# EAGLE schematic Shutdown Circuit (EAGLE 9.6.2)
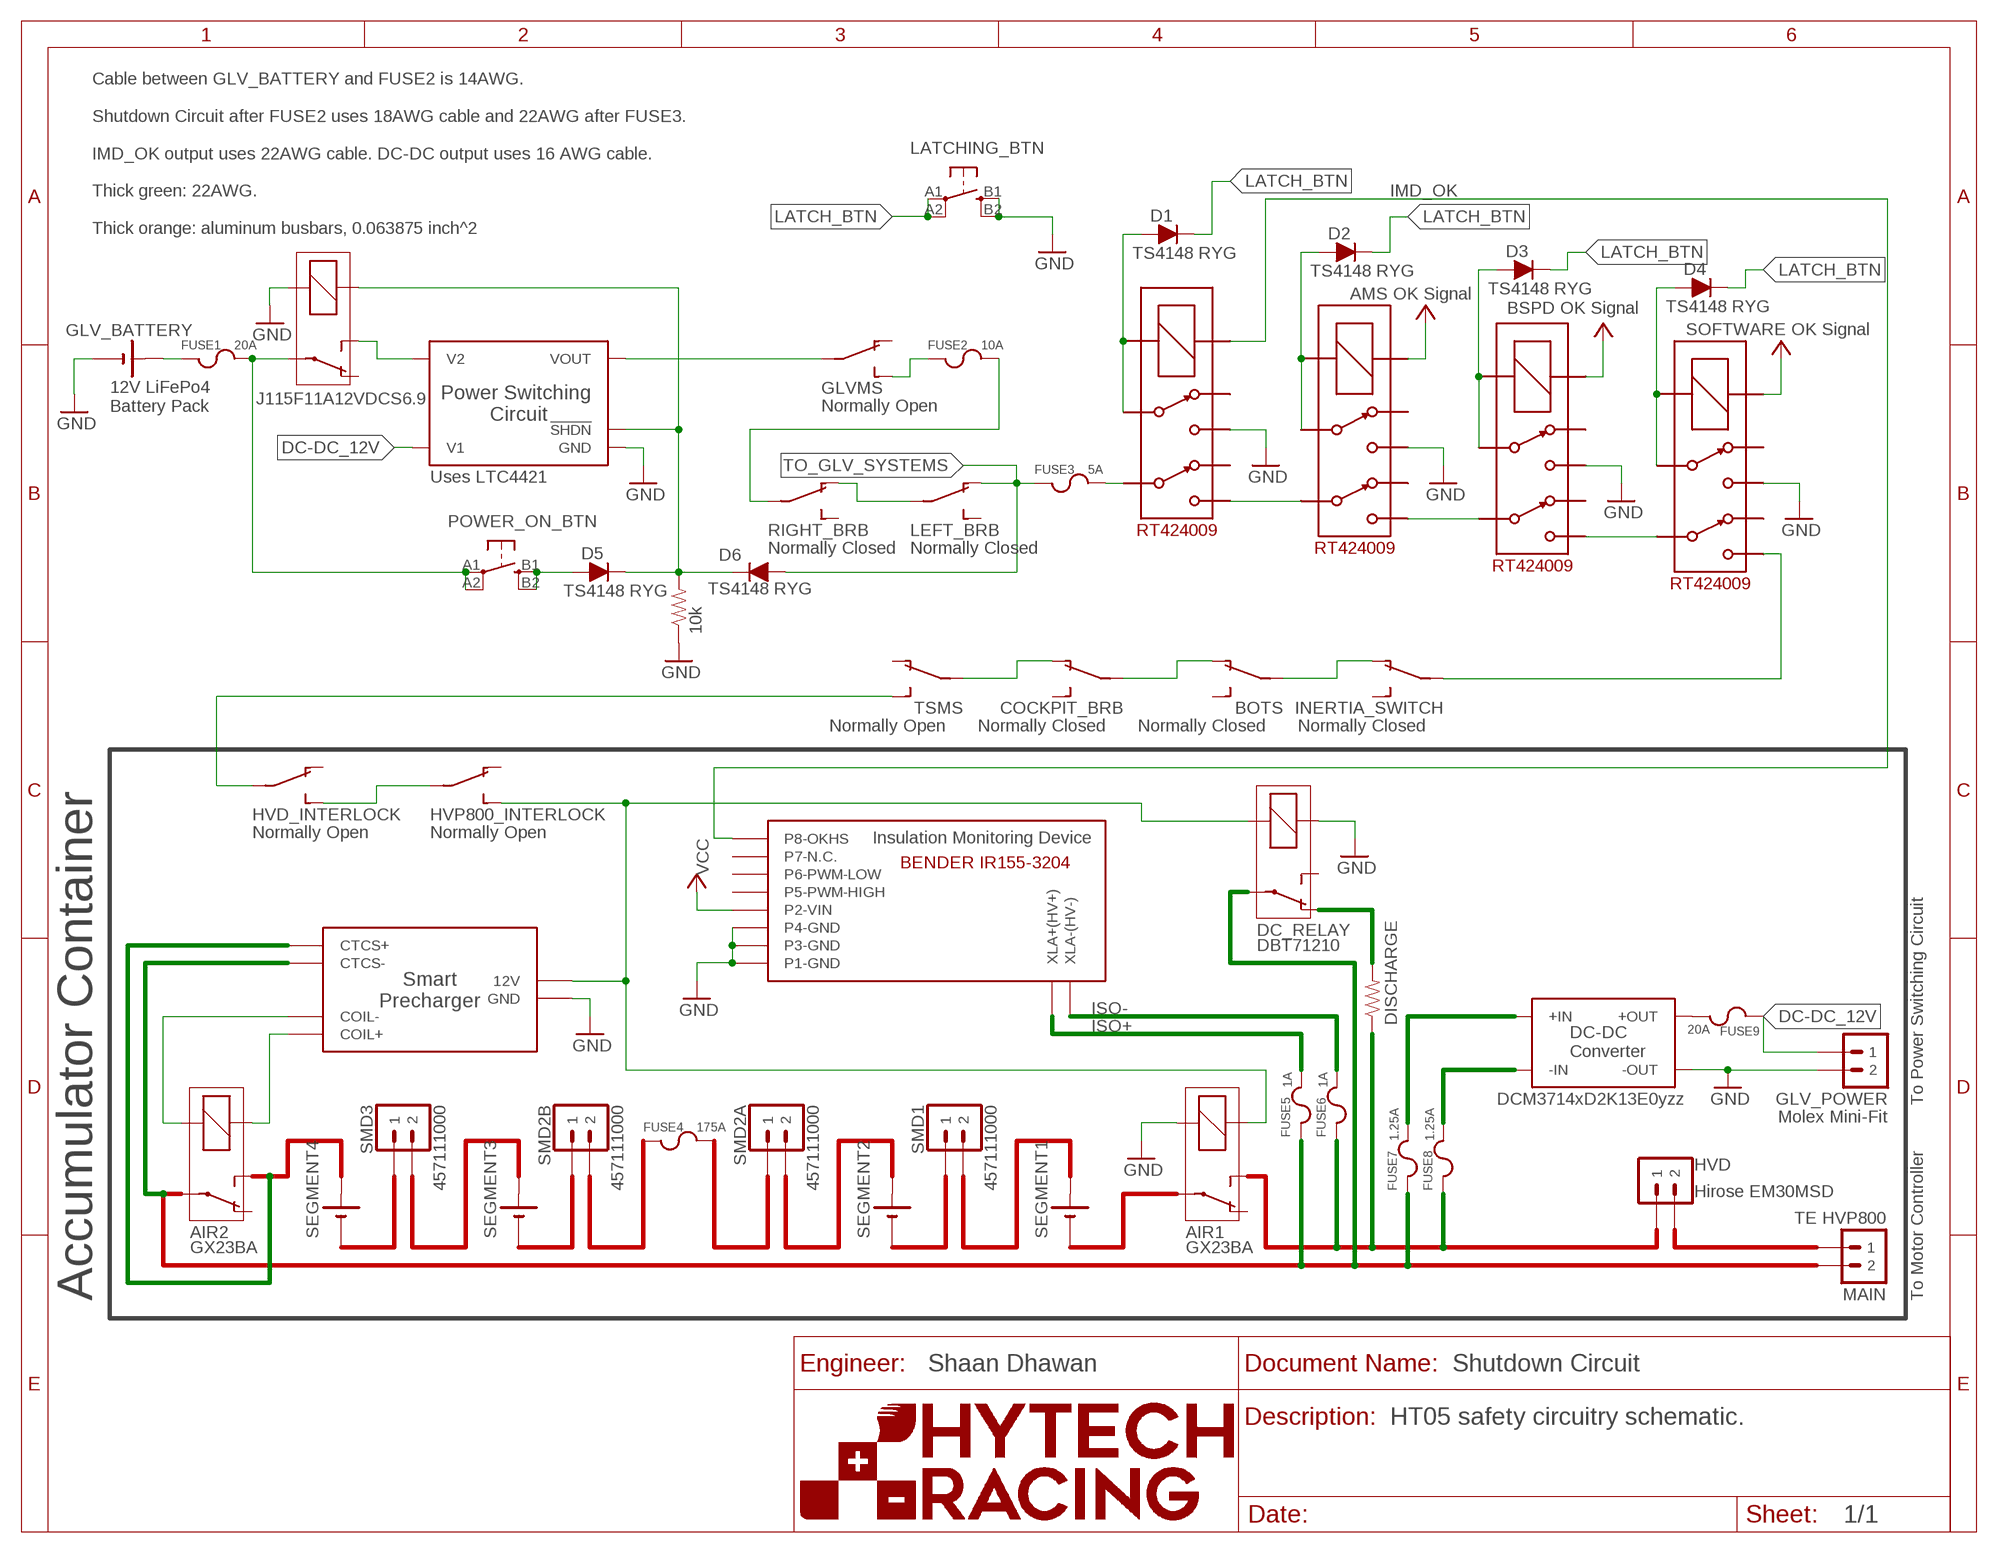
[diagram p0: schematic, sheet 1]
U$6 (FRAME_A_L): ORIENTATION: LANDSCAPE; SIZE: A

## Parts
AIR1  GX23BA  RELAY  (no package)
AIR2  GX23BA  RELAY  (no package)
BOTS  Normally Closed  SWITCH_SPST  (no package)
COCKPIT_BRB  Normally Closed  SWITCH_SPST  (no package)
D1  TS4148 RYG  DIODE0805  [0805_D]
D2  TS4148 RYG  DIODE0805  [0805_D]
D3  TS4148 RYG  DIODE0805  [0805_D]
D4  TS4148 RYG  DIODE0805  [0805_D]
D5  TS4148 RYG  DIODE0805  [0805_D]
D6  TS4148 RYG  DIODE0805  [0805_D]
DC_RELAY  DBT71210  RELAY  (no package)
DISCHARGE  RESISTOR10W  [10W_RESISTOR_VISHAY]
DISCHARGE1  10k  RESISTOR10W  [10W_RESISTOR_VISHAY]
FUSE1  20A  FUSE  (no package)
FUSE2  10A  FUSE  (no package)
FUSE3  5A  FUSE  (no package)
FUSE4  175A  FUSE  (no package)
FUSE5  1A  FUSE  (no package)
FUSE6  1A  FUSE  (no package)
FUSE7  1.25A  FUSE  (no package)
FUSE8  1.25A  FUSE  (no package)
FUSE9  20A  FUSE  (no package)
GLV_BATTERY  BATTERY_1_CELL  (no package)
GLV_POWER  Molex Mini-Fit  M02  (no package)
GLVMS  Normally Open  SWITCH_SPST  (no package)
HVD  Hirose EM30MSD  M02  (no package)
HVD_INTERLOCK  Normally Open  SWITCH_SPST  (no package)
HVP800_INTERLOCK  Normally Open  SWITCH_SPST  (no package)
INERTIA_SWITCH  Normally Closed  SWITCH_SPST  (no package)
J115F11A12VDCS6.9  RELAY  (no package)
LATCHING_BTN  BTN_10-XXSMD  [TACTILE_SWITCH_SMD_6.2MM_TALL]
LEFT_BRB  Normally Closed  SWITCH_SPST  (no package)
MAIN  TE HVP800  M02  (no package)
POWER_ON_BTN  BTN_10-XXSMD  [TACTILE_SWITCH_SMD_6.2MM_TALL]
RIGHT_BRB  Normally Closed  SWITCH_SPST  (no package)
SEGMENT1  BATTERY_1_CELL  (no package)
SEGMENT2  BATTERY_1_CELL  (no package)
SEGMENT3  BATTERY_1_CELL  (no package)
SEGMENT4  BATTERY_1_CELL  (no package)
SMD1  457111000  M02  (no package)
SMD2A  457111000  M02  (no package)
SMD2B  457111000  M02  (no package)
SMD3  457111000  M02  (no package)
TSMS  Normally Open  SWITCH_SPST  (no package)
U$1  RT424009  [RELAY_DPDT]
U$2  RT424009  [RELAY_DPDT]
U$3  RT424009  [RELAY_DPDT]
U$4  SMART_PRECHARGER  (no package)
U$5  BENDER_IR155-3204  (no package)
U$7  RT424009  [RELAY_DPDT]
U$8  DC-DC_CONVERTER  (no package)
U$9  POWER_SWITCHING_BOARD  (no package)

## Nets
+5V: U$7.COIL+ ; supply symbol labelled SOFTWARE OK Signal
DC-DC_12V: FUSE9.1 GLV_POWER.1 U$9.V1
GND: AIR1.2 DC_RELAY.1 DISCHARGE1.1 GLV_BATTERY.- GLV_POWER.2 J115F11A12VDCS6.9.2 LATCHING_BTN.B1(S) LATCHING_BTN.B2(S1) U$1.4 U$2.4 U$3.4 U$4.GND U$5.P1-GND U$5.P3-GND U$5.P4-GND U$7.4 U$8.-OUT
IMD_OK: U$1.COIL+ U$5.P8-OKHS
LATCH_BTN: D1.C D2.C D3.C LATCHING_BTN.A1(P) LATCHING_BTN.A2(P1)
N$1: FUSE1.1 GLV_BATTERY.+
N$2: GLVMS.P U$9.VOUT
N$3: FUSE2.1 GLVMS.S
N$4: FUSE2.2 RIGHT_BRB.P
N$5: LEFT_BRB.P RIGHT_BRB.O
N$6: FUSE3.2 U$1.6
N$7: U$1.5 U$2.6
N$8: U$2.5 U$3.6
N$9: INERTIA_SWITCH.P U$7.5
N$10: D1.A U$1.3 U$1.COIL-
N$11: D3.A U$3.3 U$3.COIL-
N$12: D2.A U$2.3 U$2.COIL-
N$13: DC_RELAY.P
N$14: BOTS.P INERTIA_SWITCH.O
N$15: BOTS.O COCKPIT_BRB.P
N$16: COCKPIT_BRB.O TSMS.P
N$17: AIR2.2 U$4.COIL-
N$18: AIR2.1 U$4.COIL+
N$19: FUSE9.2 U$8.+OUT
N$20: HVD_INTERLOCK.S HVP800_INTERLOCK.P
N$21: AIR1.1 DC_RELAY.2 HVP800_INTERLOCK.S U$4.12V
N$22: FUSE6.2 U$5.XLA-(HV-)
N$23: U$4.CTCS+
N$24: FUSE5.1
N$25: U$4.CTCS-
N$26: DC_RELAY.O DISCHARGE.2
N$27: FUSE5.2 U$5.XLA+(HV+)
N$28: DISCHARGE.1
N$29: U$3.5 U$7.6
N$30: FUSE6.1
N$31: D4.A U$7.3 U$7.COIL-
N$32: D4.C
N$33: FUSE8.2 U$8.-IN
N$34: FUSE7.2 U$8.+IN
N$35: FUSE7.1
N$36: FUSE1.2 J115F11A12VDCS6.9.P POWER_ON_BTN.A1(P) POWER_ON_BTN.A2(P1)
N$38: HVD_INTERLOCK.P TSMS.S
N$40: U$9.GND ; supply symbol labelled GND
N$41: D5.C D6.C DISCHARGE1.2 J115F11A12VDCS6.9.1 U$9.!SHDN
N$42: J115F11A12VDCS6.9.S U$9.V2
N$43: D5.A POWER_ON_BTN.B1(S) POWER_ON_BTN.B2(S1)
N$44: FUSE8.1
TO_GLV_SYSTEMS: D6.A FUSE3.1 LEFT_BRB.O
VCC: U$2.COIL+ U$3.COIL+ U$5.P2-VIN ; supply symbol labelled AMS OK Signal, BSPD OK Signal
Unconnected: AIR1.O AIR1.P AIR1.S AIR2.O AIR2.P AIR2.S BOTS.S COCKPIT_BRB.S DC_RELAY.S FUSE4.1 FUSE4.2 GLVMS.O HVD.1 HVD.2 HVD_INTERLOCK.O HVP800_INTERLOCK.O INERTIA_SWITCH.S J115F11A12VDCS6.9.O LEFT_BRB.S MAIN.1 MAIN.2 RIGHT_BRB.S SEGMENT1.+ SEGMENT1.- SEGMENT2.+ SEGMENT2.- SEGMENT3.+ SEGMENT3.- SEGMENT4.+ SEGMENT4.- SMD1.1 SMD1.2 SMD2A.1 SMD2A.2 SMD2B.1 SMD2B.2 SMD3.1 SMD3.2 TSMS.O U$1.2 U$1.7 U$2.2 U$2.7 U$3.2 U$3.7 U$5.P5-PWM-HIGH U$5.P6-PWM-LOW U$5.P7-N.C. U$7.2 U$7.7

## Notes on the sheet
- Cable between GLV_BATTERY and FUSE2 is 14AWG.
  
  Shutdown Circuit after FUSE2 uses 18AWG cable and 22AWG after FUSE3.
  
  IMD_OK output uses 22AWG cable. DC-DC output uses 16 AWG cable.
  
  Thick green: 22AWG.
  
  Thick orange: aluminum busbars, 0.063875 inch^2
- 12V LiFePo4 
  Battery Pack
- Uses LTC4421
- Insulation Monitoring Device
- ISO-
- ISO+
- DCM3714xD2K13E0yzz | To Power Switching Circuit
- Accumulator Container | To Motor Controller
- Shaan Dhawan
- HT05 safety circuitry schematic.

## Library data of the parts
AIR1 AIR2 DC_RELAY J115F11A12VDCS6.9 = HyTechSymbols:RELAY: RELAY 1 x switch
BOTS COCKPIT_BRB GLVMS HVD_INTERLOCK HVP800_INTERLOCK INERTIA_SWITCH LEFT_BRB RIGHT_BRB TSMS = HyTechSymbols:SWITCH_SPST: Single Pull Single Throw Switch
D1-D6 = HyTechDevices:DIODE: DIODE general purpose rectifier
DISCHARGE DISCHARGE1 = HyTechDevices:RESISTOR: Resistor Basic schematic elements and footprints for 0603, 1206, and PTH resistors.
FUSE1-FUSE9 = HyTechSymbols:FUSE: Generic Fuse
GLV_BATTERY SEGMENT1-SEGMENT4 = HyTechSymbols:BATTERY_1_CELL: Generic 1-cell battery Source: Sonnenschein
GLV_POWER HVD MAIN SMD1 SMD2A SMD2B SMD3 = HyTechSymbols:M02: Generic 2-pin connector
LATCHING_BTN POWER_ON_BTN = HyTechDevices:BTN_10-XX: Small momentary tactile push button
U$1-U$3 U$7 = HyTechDevices:RT424009: TE/Schrack Double Pull Double Throw Relay 9VDC Datasheet <https://www.mouser.com/datasheet/2/418/NG_DS_RT2_1014-736201.pdf> Product Page <https://www.te.com/usa-en/product-6-1393243-2.html>
U$4 = HyTechSymbols:SMART_PRECHARGER: Smart Precharger http://www.zeva.com.au/Products/datasheets/SmartPrechargerV1-3.pdf
U$5 = HyTechSymbols:BENDER_IR155-3204: Bender IR155-3204 Insulation Monitoring Device Datasheet <http://www.bender-es.com/fileadmin/products/doc/IR155-32xx-V004_D00115_D_XXEN.pdf>
U$8 = HyTechSymbols:DC-DC_CONVERTER
U$9 = HyTechSymbols:POWER_SWITCHING_BOARD